# Altium schematic sheet Tile1.SchDoc
size A4
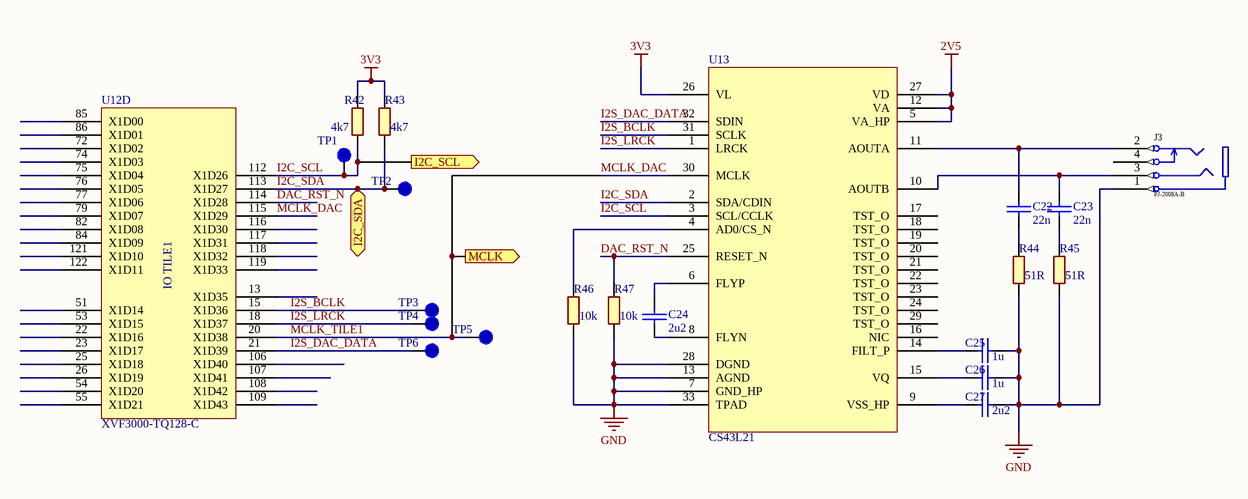
[diagram p0: Tile1.SchDoc]

## Parts
C22  22n  [C0603]
C23  22n  [C0603]
C24  2u2  [C0603]
C25  1u  [C0603]
C26  1u  [C0603]
C27  2u2  [C0603]
J3  PJ-2008A-B  [PJ-2008A-B]
R42  4k7  [R0603]
R43  4k7  [R0603]
R44  51R  [R0603]
R45  51R  [R0603]
R46  10k  [R0603]
R47  10k  [R0603]
TP1  TP  [TP1]  (value not drawn)
TP2  TP  [TP1]  (value not drawn)
TP3  TP  [TP1]  (value not drawn)
TP4  TP  [TP1]  (value not drawn)
TP5  TP  [TP1]  (value not drawn)
TP6  TP  [TP1]  (value not drawn)
U12  XVF3000-TQ128-C  [LQFP-128 - VSS]  (part D of 5)
U13  CS43L21  [QFN-32]

## Ports
I2C_SCL (out), I2C_SDA (bidir), MCLK (out)

## Nets
2V5: U13.5(VA_HP) U13.12(VA) U13.27(VD)
3V3: R42.2 R43.2 U13.26(VL)
GND: C25.2 C26.2 C27.2 J3.1 R44.1 R45.1 R46.1 R47.1 U13.7(GND_HP) U13.13(AGND) U13.28(DGND) U13.33(TPAD)
DAC_RST_N: R47.2 U12.114(X1D28) U13.25(RESET_N)
I2C_SCL: R42.1 TP1.1 U12.112(X1D26) U13.3(SCL/CCLK) ; port I2C_SCL
I2C_SDA: R43.1 TP2.1 U12.113(X1D27) U13.2(SDA/CDIN) ; port I2C_SDA
I2S_BCLK: TP3.1 U12.15(X1D36) U13.31(SCLK)
I2S_DAC_DATA: TP6.1 U12.21(X1D39) U13.32(SDIN)
I2S_LRCK: TP4.1 U12.18(X1D37) U13.1(LRCK)
MCLK_DAC: TP5.1 U12.20(X1D38) U12.115(X1D29) U13.30(MCLK) ; port MCLK  [also labelled MCLK_TILE1]
NetC22_1: C22.1 R44.2
NetC22_2: C22.2 J3.2 U13.11(AOUTA)
NetC23_1: C23.1 R45.2
NetC23_2: C23.2 J3.3 U13.10(AOUTB)
NetC24_1: C24.1 U13.6(FLYP)
NetC24_2: C24.2 U13.8(FLYN)
NetC25_1: C25.1 U13.14(FILT_P)
NetC26_1: C26.1 U13.15(VQ)
NetC27_1: C27.1 U13.9(VSS_HP)
NetR46_2: R46.2 U13.4(AD0/CS_N)

Not connected (* = marked no-connect by the designer): J3 4; U12 13(X1D35) 22(X1D16) 23(X1D17) 25(X1D18) 26(X1D19) 51(X1D14) 53(X1D15) 54(X1D20) 55(X1D21) 72(X1D02) 74(X1D03) 75(X1D04) 76(X1D05) 77(X1D06) 79(X1D07) 82(X1D08) 84(X1D09) 85(X1D00) 86(X1D01) 106(X1D40) 107(X1D41) 108(X1D42) 109(X1D43) 116(X1D30) 117(X1D31) 118(X1D32) 119(X1D33) 121(X1D10) 122(X1D11); U13 16(NIC) 17(TST_O) 18(TST_O) 19(TST_O) 20(TST_O) 21(TST_O) 22(TST_O) 23(TST_O) 24(TST_O) 29(TST_O)

## Notes on the sheet
- (in symbol XVF3000-TQ128-C, part D) IO TILE1

## Library data of the parts
C22-C27 = CAP: Capacitor
R42-R47 = R: RES